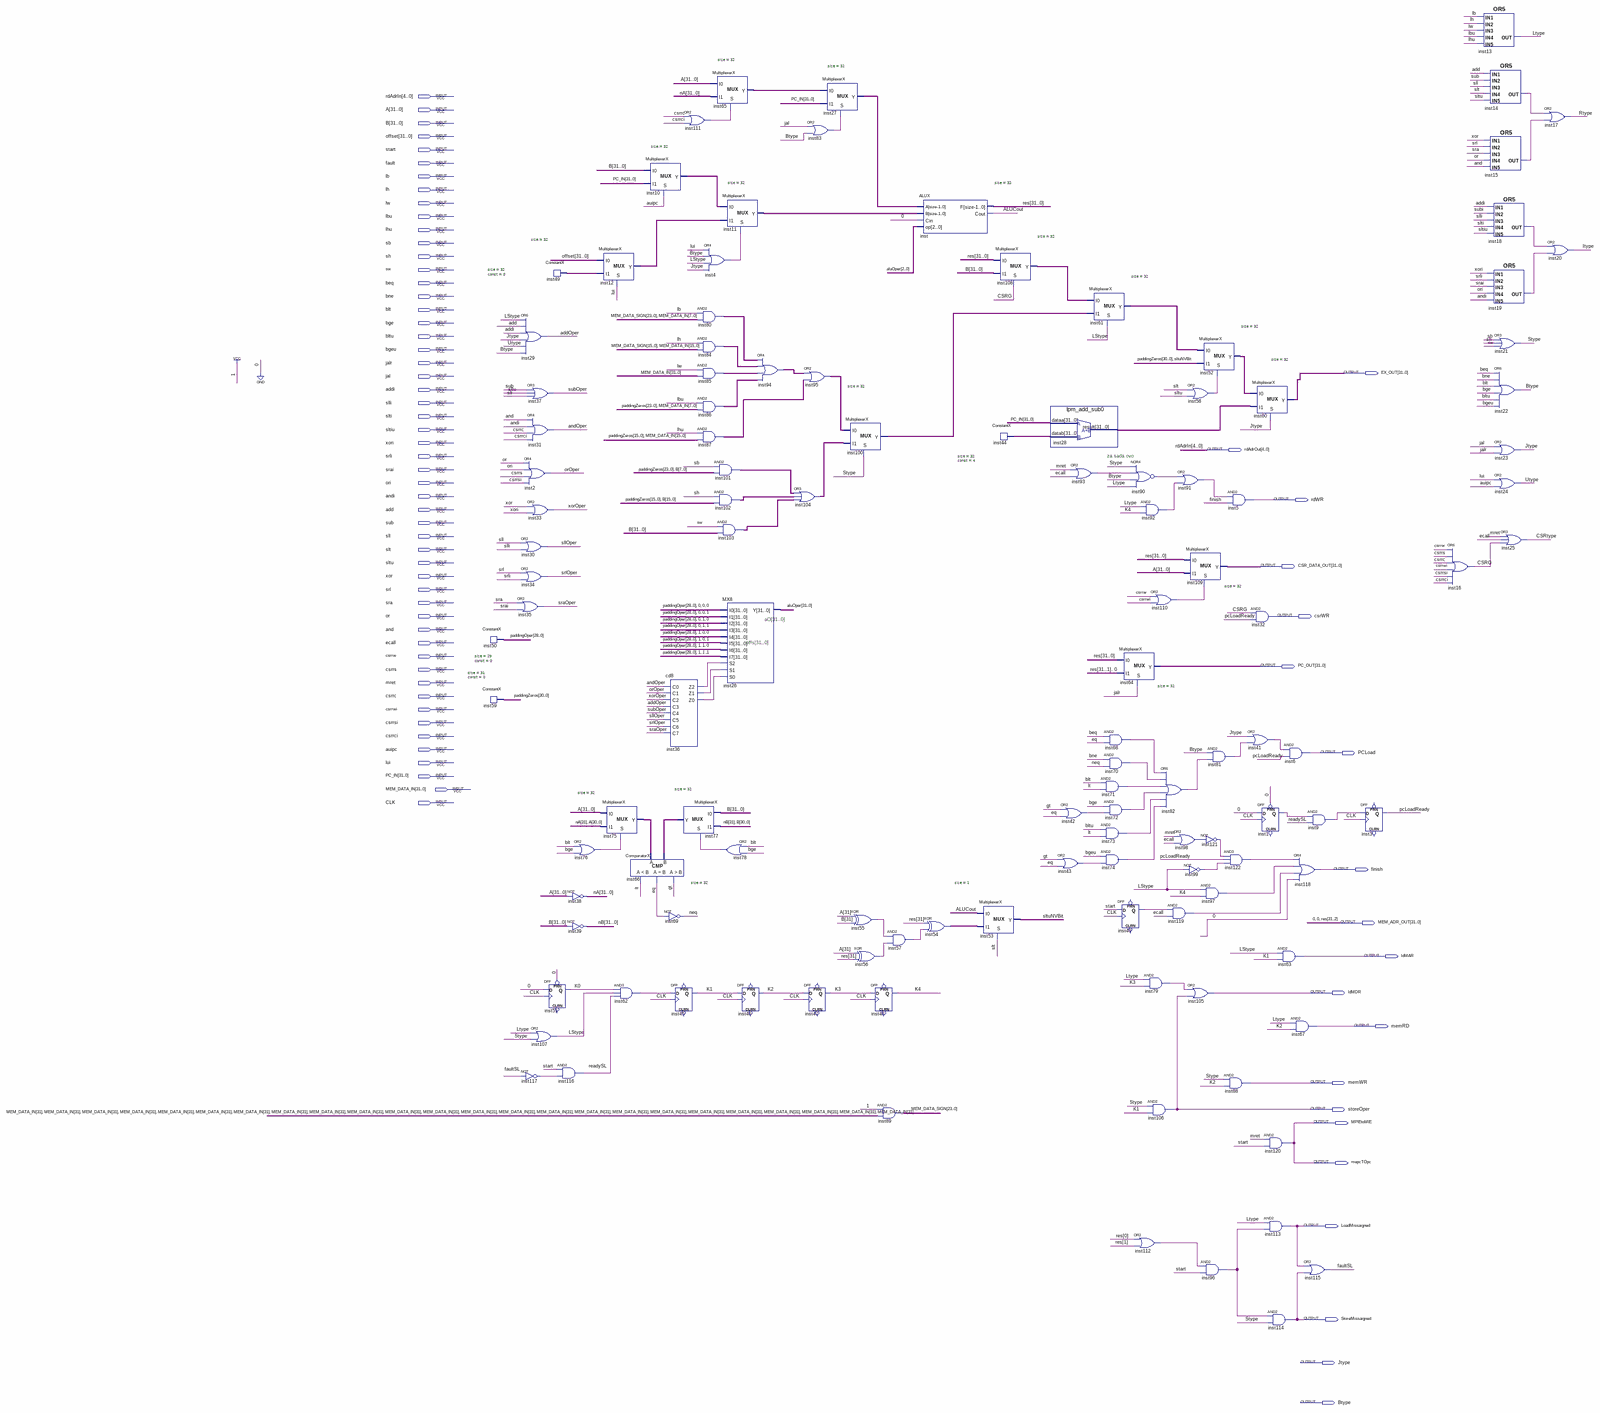
[diagram p0: schematic sheet, whole]
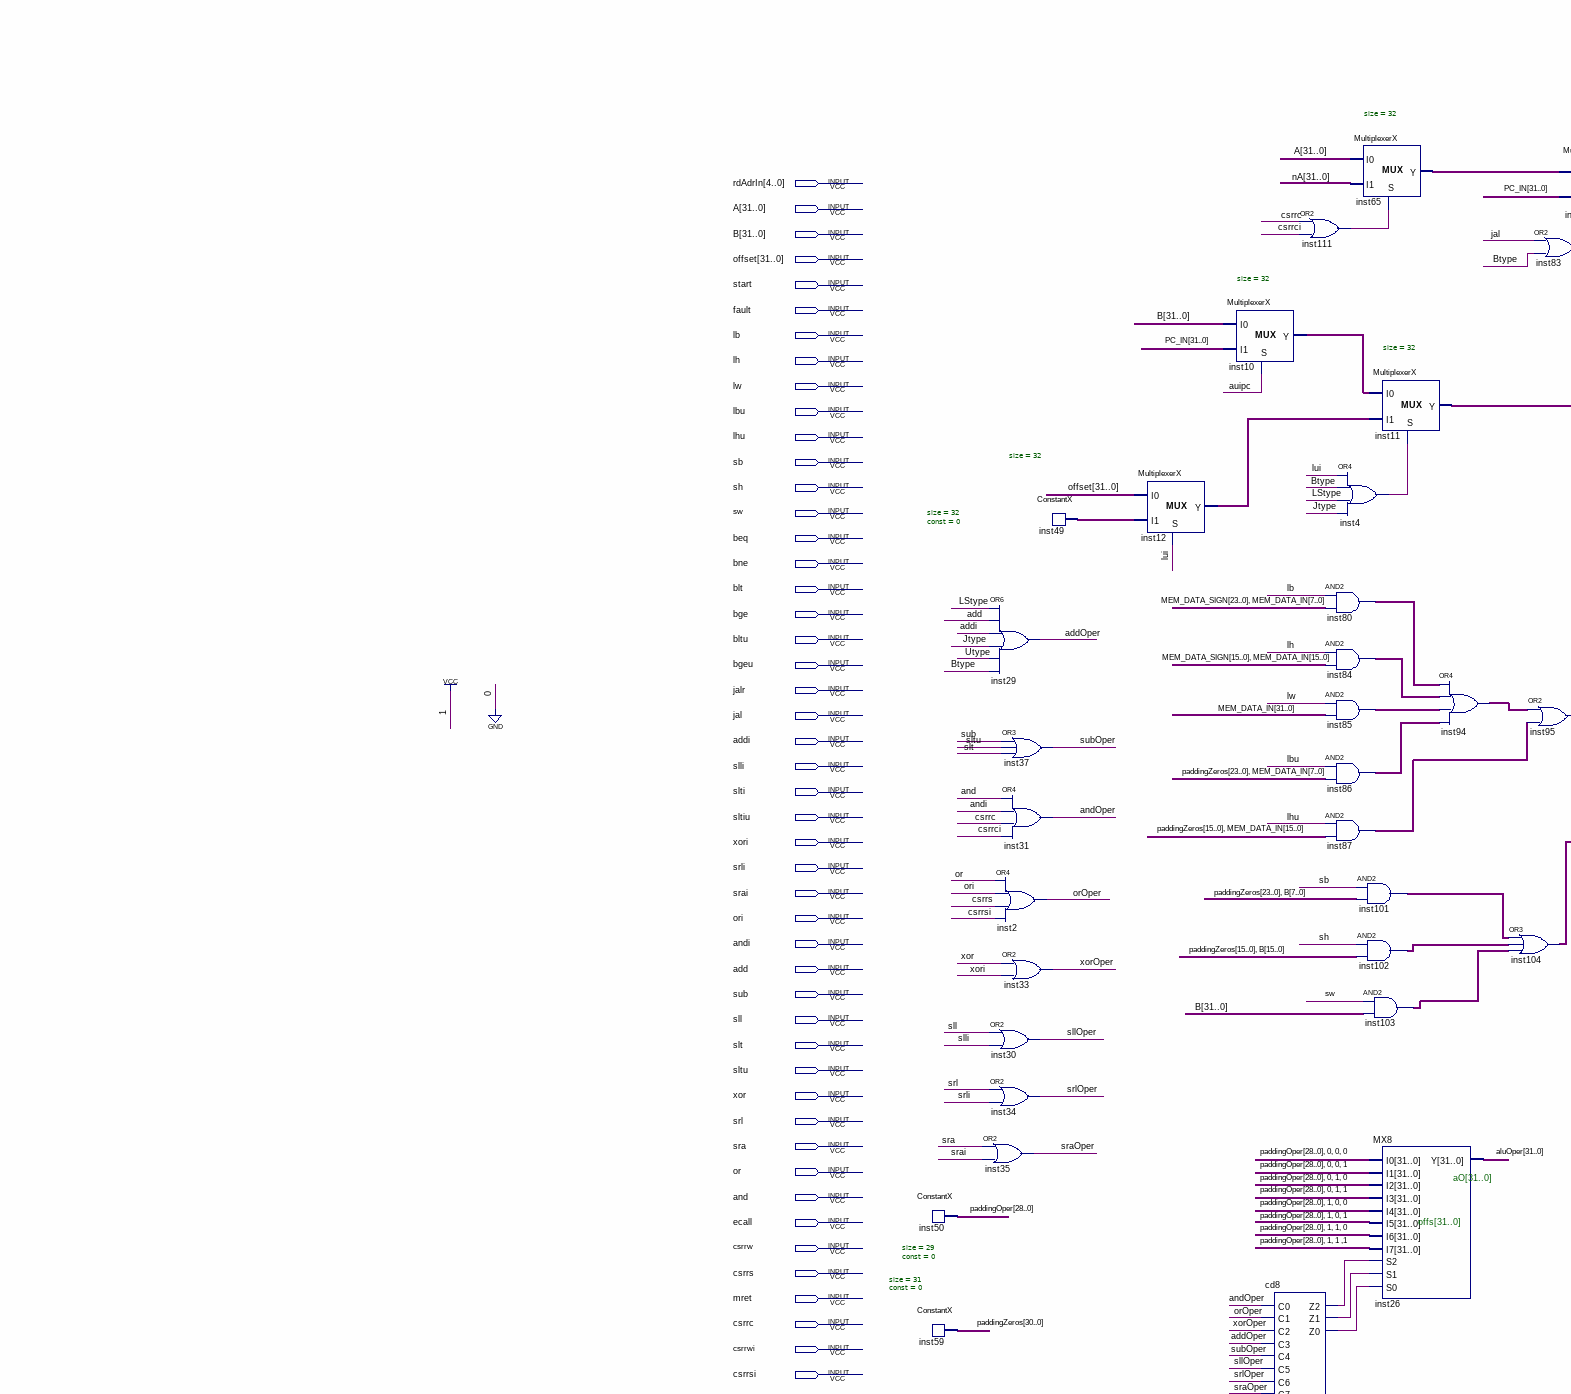
[diagram p1: schematic sheet, upper left part]
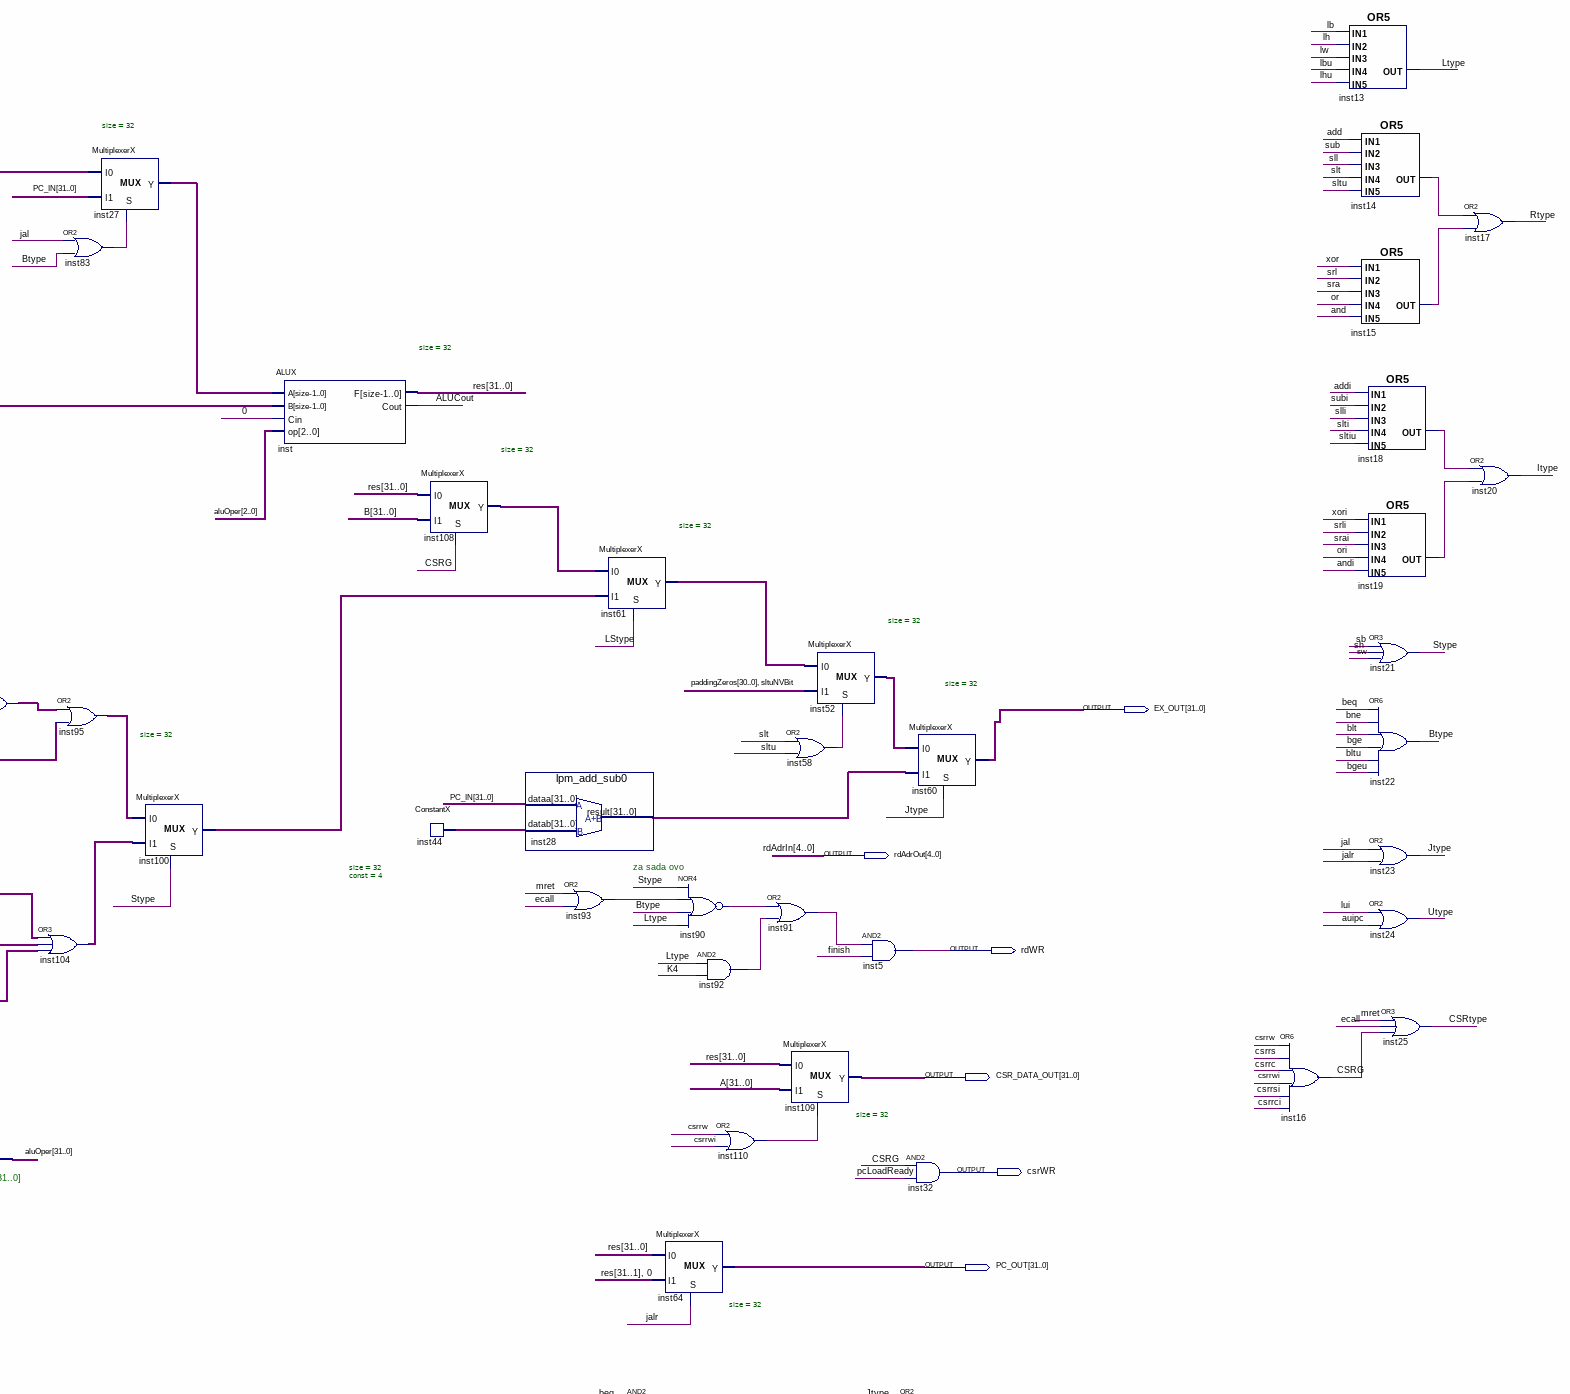
[diagram p2: schematic sheet, upper right part]
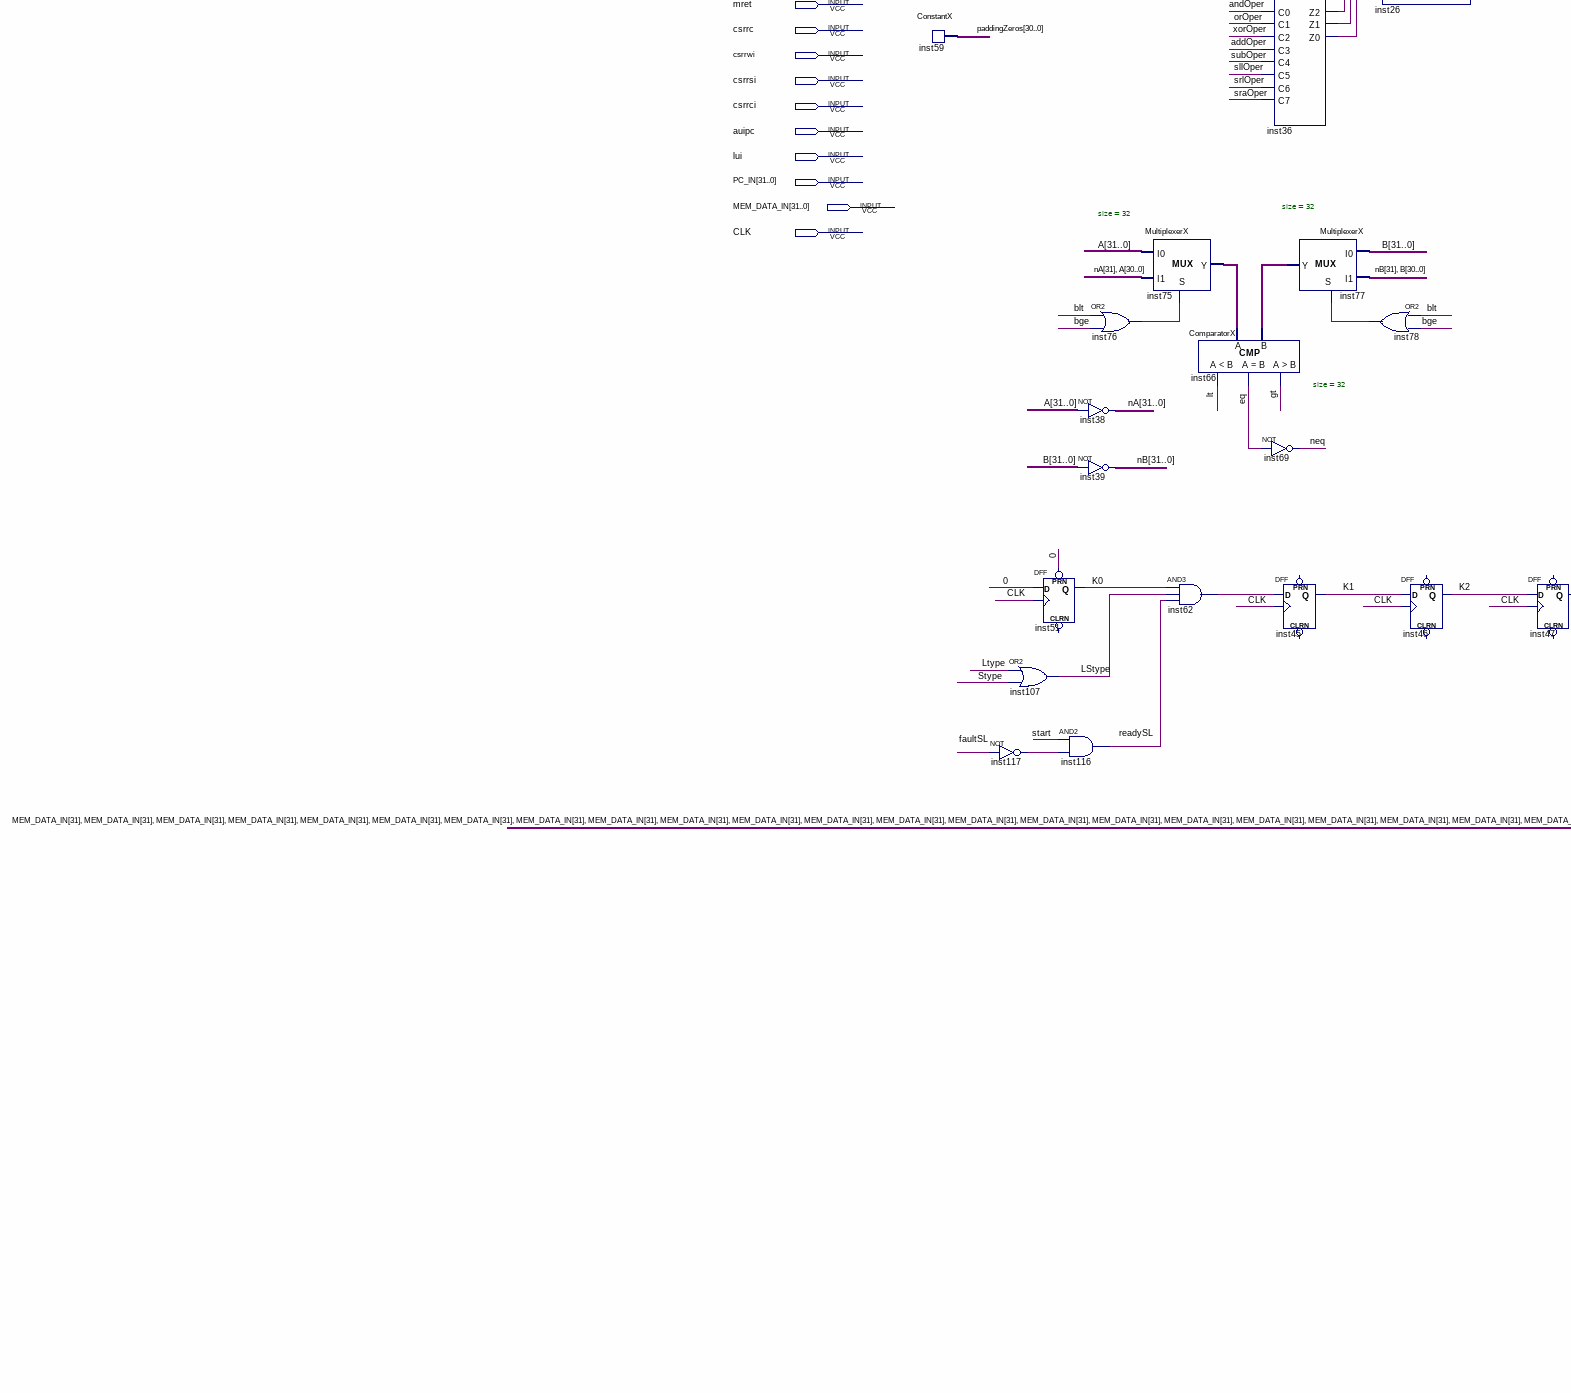
[diagram p3: schematic sheet, lower left part]
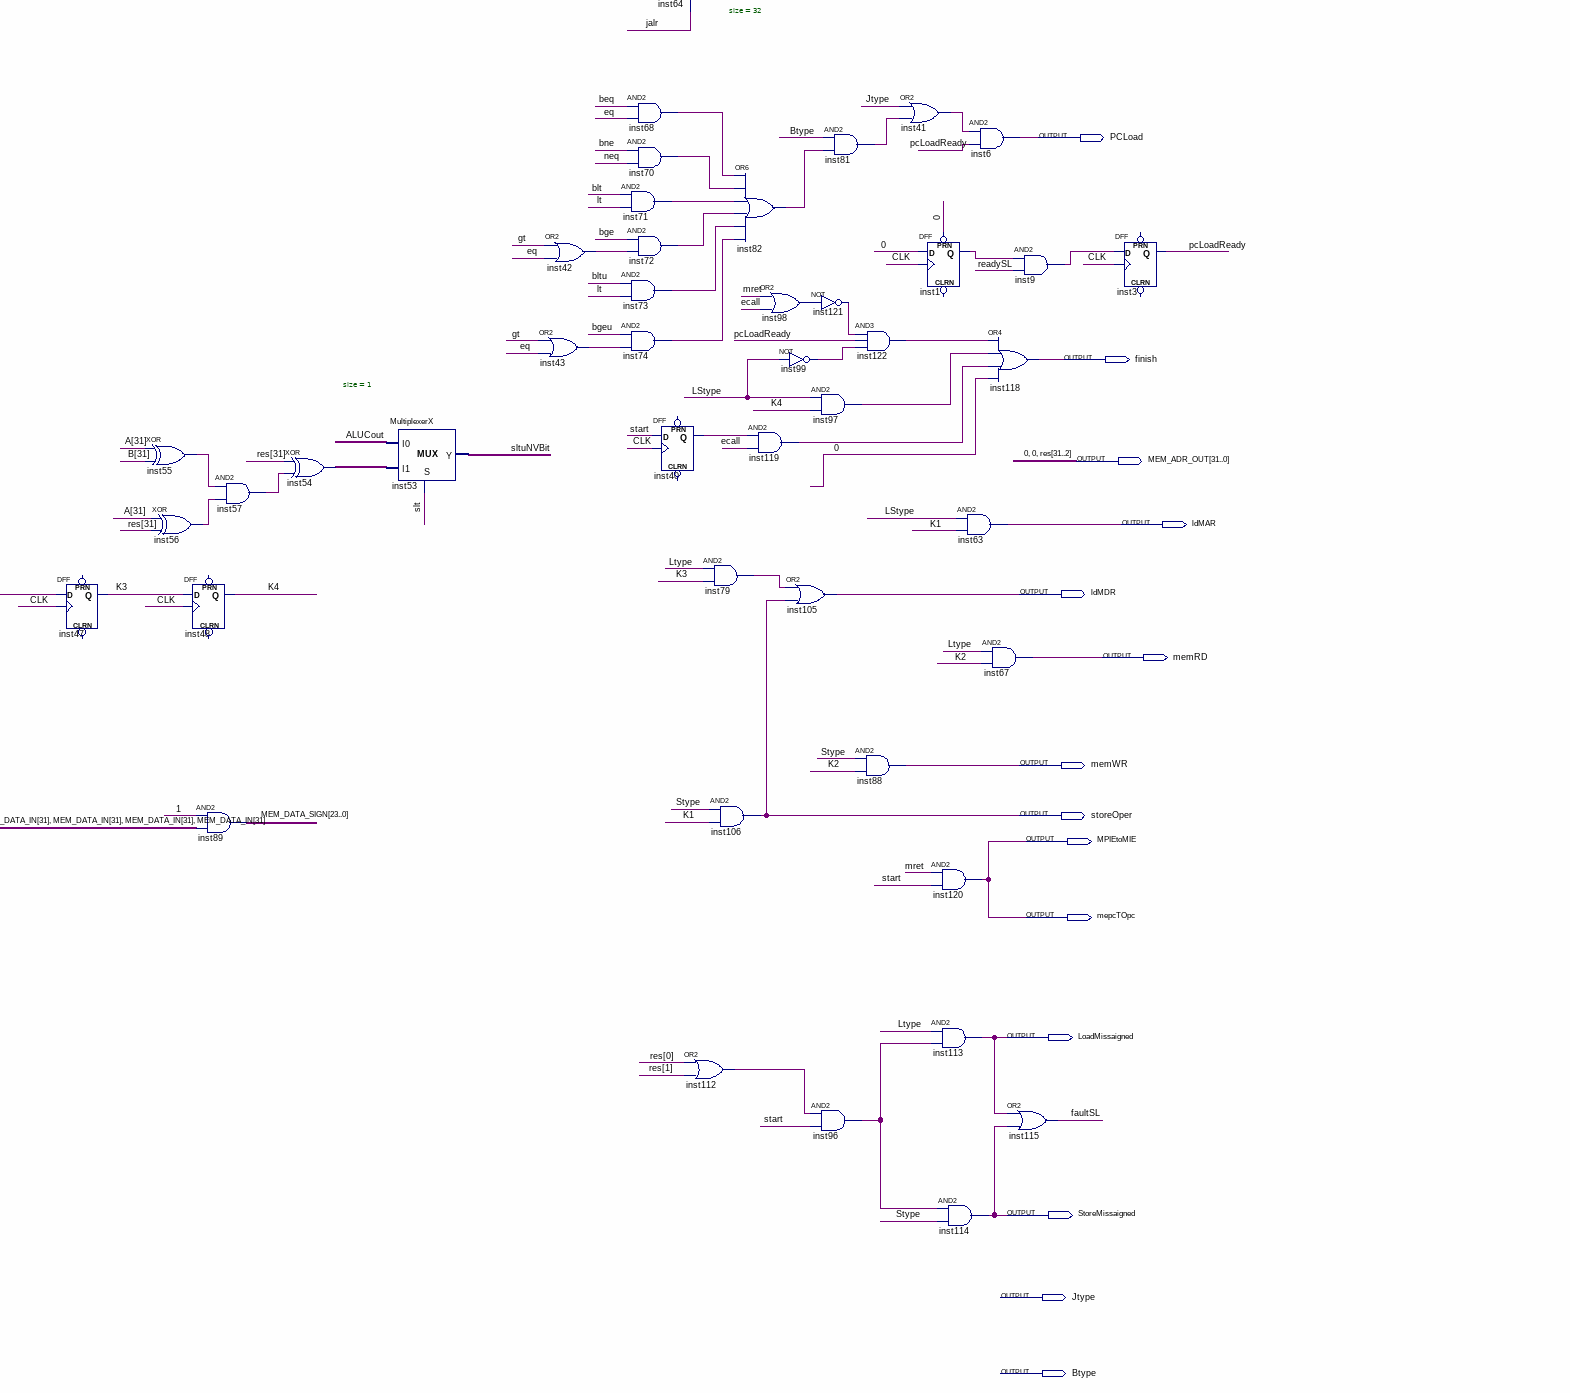
[diagram p4: schematic sheet, lower right part]
// Quartus schematic ExecuteFaza.bdf as structural Verilog: 121 symbols, 74 pins
module ExecuteFaza (
  input  [4:0] rdAdrIn,
  input  [31:0] A,
  input  [31:0] B,
  input  [31:0] offset,
  input  start,
  input  fault,
  input  lb,
  input  lh,
  input  lw,
  input  lbu,
  input  lhu,
  input  sb,
  input  sh,
  input  sw,
  input  beq,
  input  bne,
  input  blt,
  input  bge,
  input  bltu,
  input  bgeu,
  input  jalr,
  input  jal,
  input  addi,
  input  slli,
  input  slti,
  input  sltiu,
  input  xori,
  input  srli,
  input  srai,
  input  ori,
  input  andi,
  input  add,
  input  sub,
  input  sll,
  input  slt,
  input  sltu,
  input  \xor ,
  input  srl,
  input  sra,
  input  \or ,
  input  \and ,
  input  ecall,
  input  csrrw,
  input  csrrs,
  input  mret,
  input  csrrc,
  input  csrrwi,
  input  csrrsi,
  input  csrrci,
  input  auipc,
  input  lui,
  input  [31:0] PC_IN,
  input  [31:0] MEM_DATA_IN,
  input  CLK,
  output [31:0] EX_OUT,
  output [4:0] rdAdrOut,
  output rdWR,
  output [31:0] CSR_DATA_OUT,
  output csrWR,
  output [31:0] PC_OUT,
  output PCLoad,
  output finish,
  output [31:0] MEM_ADR_OUT,
  output ldMAR,
  output ldMDR,
  output memRD,
  output memWR,
  output storeOper,
  output MPIEtoMIE,
  output mepcTOpc,
  output LoadMissaigned,
  output StoreMissaigned,
  output Jtype,
  output Btype
);

  wire addOper, ALUCout, andOper, CSRG, CSRtype, eq, faultSL, gt, inst1_q, inst4_out, inst9_out, inst14_out,
       inst15_out, inst18_out, inst19_out, inst36_z0, inst36_z1, inst36_z2, inst40_q, inst41_out, inst42_out,
       inst43_out, inst54_out, inst55_out, inst56_out, inst57_out, inst58_out, inst62_out, inst68_out,
       inst70_out, inst71_out, inst72_out, inst73_out, inst74_out, inst76_out, inst78_out, inst79_out,
       inst81_out, inst82_out, inst83_out, inst90_out, inst91_out, inst92_out, inst93_out, inst96_out,
       inst97_out, inst98_out, inst99_out, inst110_out, inst111_out, inst112_out, inst117_out, inst119_out,
       inst121_out, inst122_out, Itype, K0, K1, K2, K3, K4, LStype, lt, Ltype, neq, orOper, pcLoadReady,
       readySL, Rtype, sllOper, sltuNVBit, sraOper, srlOper, Stype, subi, subOper, Utype, xorOper;
  wire [1:0] res;
  wire [23:0] MEM_DATA_SIGN;
  wire [28:0] paddingOper;
  wire [30:0] paddingZeros;
  wire [31:0] aluOper, inst10_y, inst11_y, inst12_y, inst27_y, inst28_result, inst44_data_out,
       inst49_data_out, inst52_y, inst61_y, inst65_y, inst75_y, inst77_y, inst80_out, inst84_out, inst85_out,
       inst86_out, inst87_out, inst94_out, inst95_out, inst100_y, inst101_out, inst102_out, inst103_out,
       inst104_out, inst108_y, nA, nB;

  ConstantX #(.size(29), .\const (0)) inst50 (.DATA_OUT(paddingOper));
  ConstantX #(.size(31), .\const (0)) inst59 (.DATA_OUT(paddingZeros));
  or inst29 (addOper, LStype, add, addi, Jtype, Utype, Btype);
  or inst37 (subOper, sub, sltu, slt);
  or inst31 (andOper, \and , andi, csrrc, csrrci);
  or inst2 (orOper, \or , ori, csrrs, csrrsi);
  or inst33 (xorOper, \xor , xori);
  or inst30 (sllOper, sll, slli);
  or inst34 (srlOper, srl, srli);
  or inst35 (sraOper, sra, srai);
  or inst107 (LStype, Ltype, Stype);
  not inst117 (inst117_out, faultSL);
  ConstantX #(.size(32), .\const (0)) inst49 (.DATA_OUT(inst49_data_out));
  DFF inst51 (.CLK(CLK), .D(1'b0), .PRN(1'b0), .Q(K0));  // open: CLRN
  and inst116 (readySL, start, inst117_out);
  or inst76 (inst76_out, blt, bge);
  assign nA = ~A;  // NOT inst38, 32 bits wide
  assign nB = ~B;  // NOT inst39, 32 bits wide
  MultiplexerX #(.size(32)) inst12 (.S(lui), .I0(offset), .I1(inst49_data_out), .Y(inst12_y));
  MultiplexerX #(.size(32)) inst75 (.S(inst76_out), .I0(A), .I1({nA[31], A[30:0]}), .Y(inst75_y));
  ComparatorX #(.size(32)) inst66 (.A(inst75_y), .B(inst77_y), .LS(lt), .EQ(eq), .GR(gt));
  and inst62 (inst62_out, K0, LStype, readySL);
  MultiplexerX #(.size(32)) inst10 (.S(auipc), .I0(B), .I1(PC_IN), .Y(inst10_y));
  cd8 inst36 (
    .C0(andOper), .C1(orOper), .C2(xorOper), .C3(addOper), .C4(subOper), .C5(sllOper), .C6(srlOper),
    .C7(sraOper), .Z2(inst36_z2), .Z1(inst36_z1), .Z0(inst36_z0));
  not inst69 (neq, eq);
  or inst111 (inst111_out, csrrc, csrrci);
  MultiplexerX #(.size(32)) inst77 (.S(inst78_out), .I0(B), .I1({nB[31], B[30:0]}), .Y(inst77_y));
  DFF inst45 (.CLK(CLK), .D(inst62_out), .Q(K1));  // open: CLRN, PRN
  MultiplexerX #(.size(32)) inst65 (.S(inst111_out), .I0(A), .I1(nA), .Y(inst65_y));
  or inst4 (inst4_out, lui, Btype, LStype, Jtype);
  assign inst80_out = {32{lb}} & {MEM_DATA_SIGN, MEM_DATA_IN[7:0]};  // AND2 inst80, 32 bits wide
  assign inst84_out = {32{lh}} & {MEM_DATA_SIGN[15:0], MEM_DATA_IN[15:0]};  // AND2 inst84, 32 bits wide
  assign inst85_out = {32{lw}} & MEM_DATA_IN;  // AND2 inst85, 32 bits wide
  assign inst86_out = {32{lbu}} & {paddingZeros[23:0], MEM_DATA_IN[7:0]};  // AND2 inst86, 32 bits wide
  assign inst87_out = {32{lhu}} & {paddingZeros[15:0], MEM_DATA_IN[15:0]};  // AND2 inst87, 32 bits wide
  assign inst101_out = {32{sb}} & {paddingZeros[23:0], B[7:0]};  // AND2 inst101, 32 bits wide
  assign inst102_out = {32{sh}} & {paddingZeros[15:0], B[15:0]};  // AND2 inst102, 32 bits wide
  assign inst103_out = {32{sw}} & B;  // AND2 inst103, 32 bits wide
  MultiplexerX #(.size(32)) inst11 (.S(inst4_out), .I0(inst10_y), .I1(inst12_y), .Y(inst11_y));
  MX8 inst26 (
    .I0({paddingOper, 3'b000}), .I1({paddingOper, 3'b001}), .I2({paddingOper, 3'b010}),
    .I3({paddingOper, 3'b011}), .I4({paddingOper, 3'b100}), .I5({paddingOper, 3'b101}),
    .I6({paddingOper, 3'b110}), .I7({paddingOper, 3'b111}), .S2(inst36_z2), .S1(inst36_z1), .S0(inst36_z0),
    .Y(aluOper));
  or inst78 (inst78_out, blt, bge);
  DFF inst46 (.CLK(CLK), .D(K1), .Q(K2));  // open: CLRN, PRN
  assign inst94_out = inst80_out | inst84_out | inst85_out | inst86_out;  // OR4 inst94, 32 bits wide
  assign inst104_out = inst101_out | inst102_out | inst103_out;  // OR3 inst104, 32 bits wide
  MultiplexerX #(.size(32)) inst27 (.S(inst83_out), .I0(inst65_y), .I1(PC_IN), .Y(inst27_y));
  or inst83 (inst83_out, jal, Btype);
  assign inst95_out = inst94_out | inst87_out;  // OR2 inst95, 32 bits wide
  DFF inst47 (.CLK(CLK), .D(K2), .Q(K3));  // open: CLRN, PRN
  MultiplexerX #(.size(32)) inst100 (.S(Stype), .I0(inst95_out), .I1(inst104_out), .Y(inst100_y));
  xor inst55 (inst55_out, A[31], B[31]);
  xor inst56 (inst56_out, A[31], MEM_ADR_OUT[29]);
  DFF inst48 (.CLK(CLK), .D(K3), .Q(K4));  // open: CLRN, PRN
  assign MEM_DATA_SIGN = {24{1'b1}} & {24{MEM_DATA_IN[31]}};  // AND2 inst89, 24 bits wide
  and inst57 (inst57_out, inst55_out, inst56_out);
  ALUX #(.size(32)) inst (
    .A(inst27_y), .B(inst11_y), .Cin(1'b0), .op(aluOper[2:0]), .F({MEM_ADR_OUT[29:0], res}), .Cout(ALUCout));
  xor inst54 (inst54_out, MEM_ADR_OUT[29], inst57_out);
  MultiplexerX #(.size(1)) inst53 (.S(slt), .I0(ALUCout), .I1(inst54_out), .Y(sltuNVBit));
  MultiplexerX #(.size(32)) inst108 (.S(CSRG), .I0({MEM_ADR_OUT[29:0], res}), .I1(B), .Y(inst108_y));
  ConstantX #(.size(32), .\const (4)) inst44 (.DATA_OUT(inst44_data_out));
  lpm_add_sub0 inst28 (.dataa(PC_IN), .datab(inst44_data_out), .result(inst28_result));
  or inst42 (inst42_out, gt, eq);
  or inst43 (inst43_out, gt, eq);
  MultiplexerX #(.size(32)) inst61 (.S(LStype), .I0(inst108_y), .I1(inst100_y), .Y(inst61_y));
  or inst93 (inst93_out, mret, ecall);
  MultiplexerX #(.size(32)) inst64 (
    .S(jalr), .I0({MEM_ADR_OUT[29:0], res}), .I1({MEM_ADR_OUT[29:0], res[1], 1'b0}), .Y(PC_OUT));
  and inst68 (inst68_out, beq, eq);
  and inst70 (inst70_out, bne, neq);
  and inst71 (inst71_out, blt, lt);
  and inst72 (inst72_out, bge, inst42_out);
  and inst73 (inst73_out, bltu, lt);
  and inst74 (inst74_out, bgeu, inst43_out);
  DFF inst40 (.CLK(CLK), .D(start), .Q(inst40_q));  // open: CLRN, PRN
  nor inst90 (inst90_out, Stype, inst93_out, Btype, Ltype);
  and inst92 (inst92_out, Ltype, K4);
  and inst79 (inst79_out, Ltype, K3);
  or inst112 (inst112_out, res[0], res[1]);
  or inst110 (inst110_out, csrrw, csrrwi);
  or inst82 (inst82_out, inst68_out, inst70_out, inst71_out, inst72_out, inst73_out, inst74_out);
  and inst119 (inst119_out, inst40_q, ecall);
  and inst106 (storeOper, Stype, K1);
  MultiplexerX #(.size(32)) inst52 (.S(inst58_out), .I0(inst61_y), .I1({paddingZeros, sltuNVBit}), .Y(inst52_y));
  or inst58 (inst58_out, slt, sltu);
  or inst91 (inst91_out, inst90_out, inst92_out);
  MultiplexerX #(.size(32)) inst109 (.S(inst110_out), .I0({MEM_ADR_OUT[29:0], res}), .I1(A), .Y(CSR_DATA_OUT));
  or inst98 (inst98_out, mret, ecall);
  not inst99 (inst99_out, LStype);
  or inst105 (ldMDR, inst79_out, storeOper);
  and inst81 (inst81_out, Btype, inst82_out);
  not inst121 (inst121_out, inst98_out);
  and inst122 (inst122_out, inst121_out, pcLoadReady, inst99_out);
  and inst97 (inst97_out, LStype, K4);
  and inst88 (memWR, Stype, K2);
  and inst96 (inst96_out, inst112_out, start);
  MultiplexerX #(.size(32)) inst60 (.S(Jtype), .I0(inst52_y), .I1(inst28_result), .Y(EX_OUT));
  and inst5 (rdWR, inst91_out, finish);
  and inst32 (csrWR, CSRG, pcLoadReady);
  or inst41 (inst41_out, Jtype, inst81_out);
  DFF inst1 (.CLK(CLK), .D(1'b0), .PRN(1'b0), .Q(inst1_q));  // open: CLRN
  and inst63 (ldMAR, LStype, K1);
  and inst120 (mepcTOpc, mret, start);
  and inst113 (LoadMissaigned, Ltype, inst96_out);
  and inst114 (StoreMissaigned, inst96_out, Stype);
  and inst6 (PCLoad, inst41_out, pcLoadReady);
  or inst118 (finish, inst122_out, inst97_out, inst119_out, 1'b0);
  and inst67 (memRD, Ltype, K2);
  or inst115 (faultSL, LoadMissaigned, StoreMissaigned);
  and inst9 (inst9_out, inst1_q, readySL);
  DFF inst3 (.CLK(CLK), .D(inst9_out), .Q(pcLoadReady));  // open: CLRN, PRN
  or inst16 (CSRG, csrrw, csrrs, csrrc, csrrwi, csrrsi, csrrci);
  or inst13 (Ltype, lb, lh, lw, lbu, lhu);
  or inst14 (inst14_out, add, sub, sll, slt, sltu);
  or inst15 (inst15_out, \xor , srl, sra, \or , \and );
  or inst18 (inst18_out, addi, subi, slli, slti, sltiu);
  or inst19 (inst19_out, xori, srli, srai, ori, andi);
  or inst21 (Stype, sb, sh, sw);
  or inst22 (Btype, beq, bne, blt, bge, bltu, bgeu);
  or inst23 (Jtype, jal, jalr);
  or inst24 (Utype, lui, auipc);
  or inst25 (CSRtype, mret, ecall, CSRG);
  or inst17 (Rtype, inst14_out, inst15_out);
  or inst20 (Itype, inst18_out, inst19_out);

  assign MEM_ADR_OUT[31:30] = 2'b00;
  assign MPIEtoMIE = mepcTOpc;
  assign rdAdrOut = rdAdrIn;

  // Other names for the same wires on the sheet: res[31:2] = MEM_ADR_OUT[29:0]

  // Notes on the sheet:
  //   za sada ovo
  //   aO[31..0]
  //   offs[31..0]
endmodule
